# EAGLE schematic motion_detect (EAGLE 7.7.0)
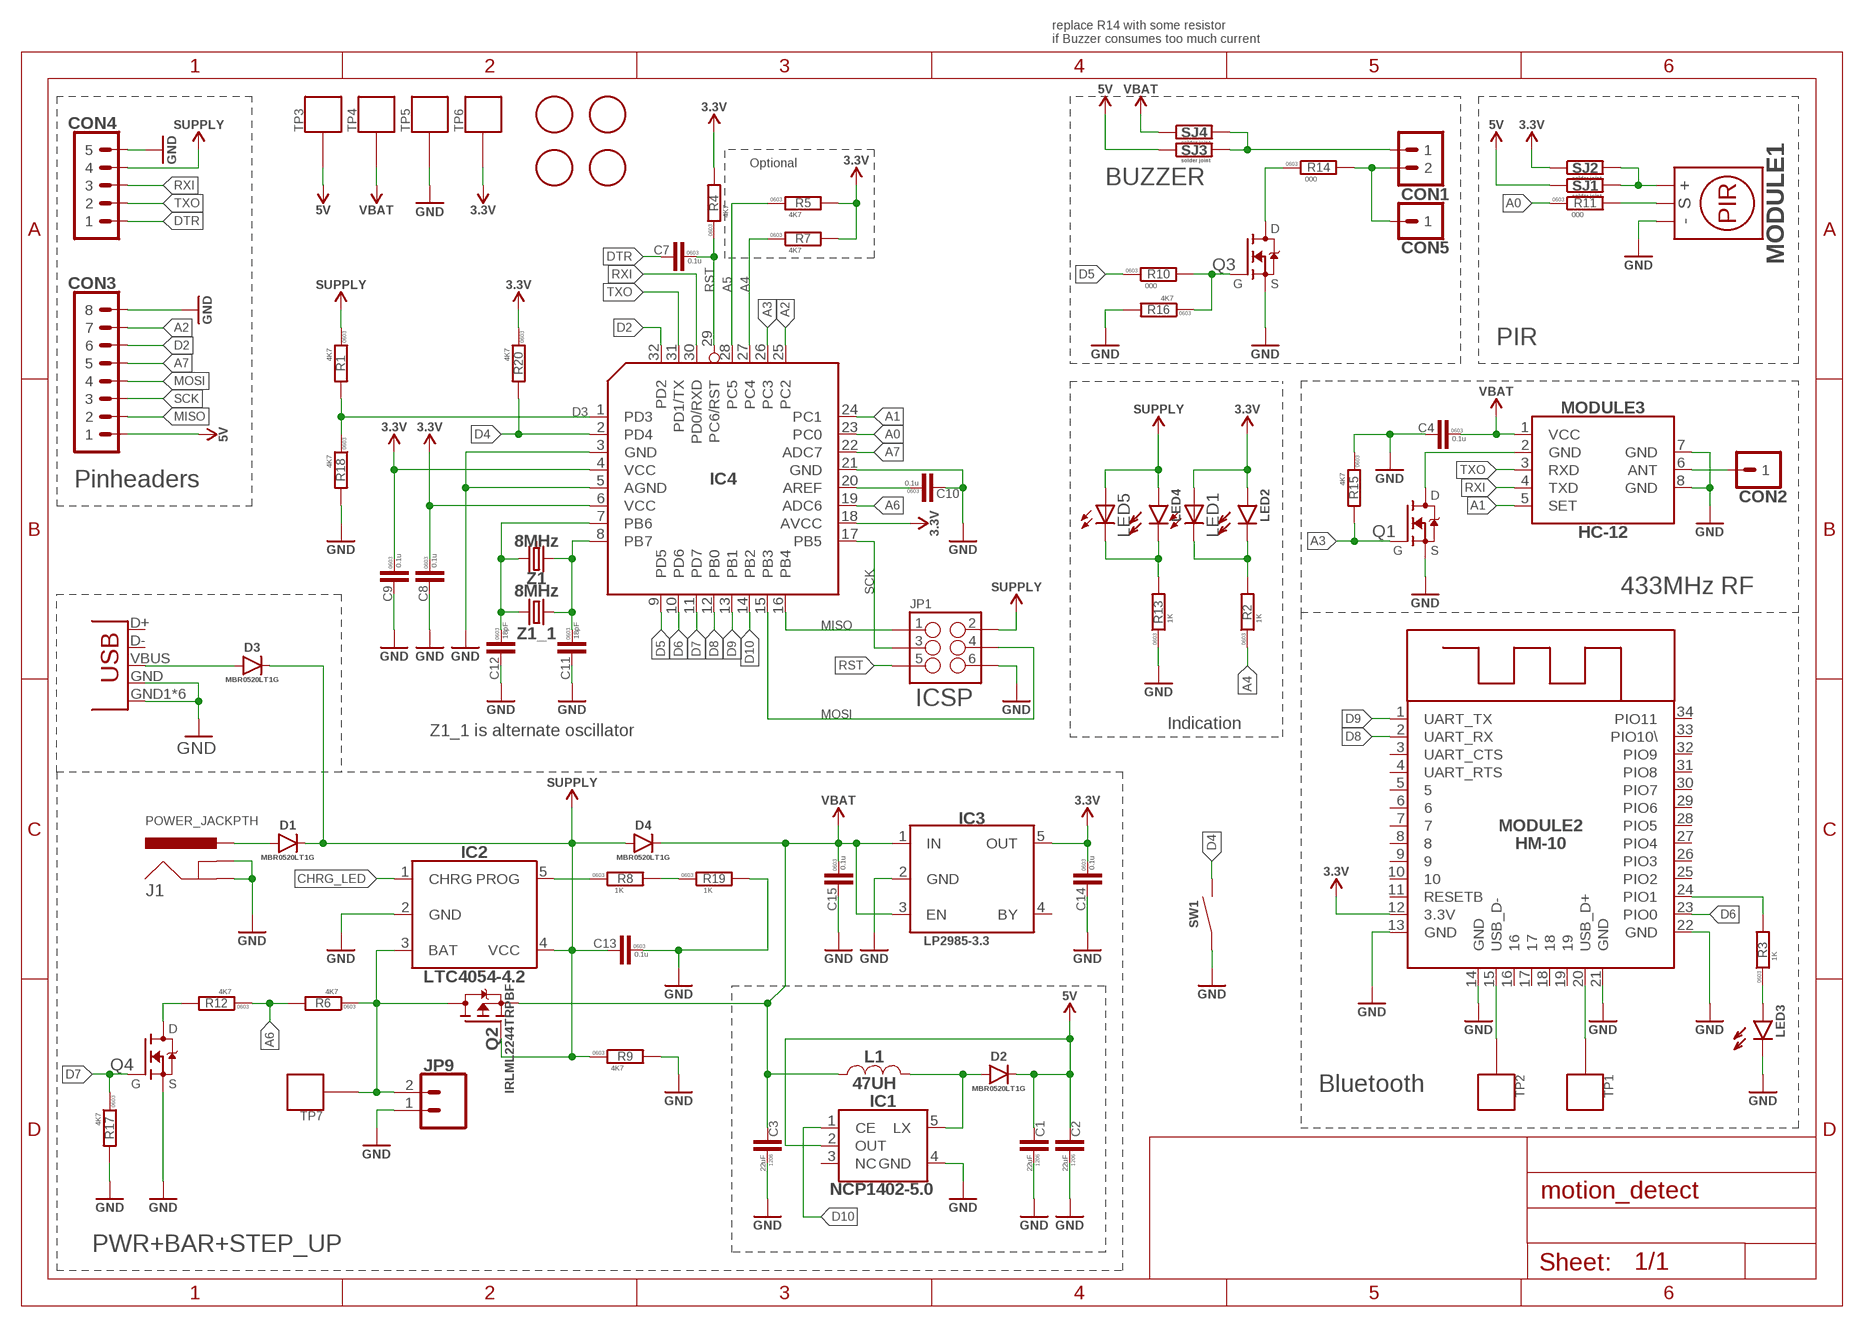
[diagram p0: schematic, sheet 1]

## Parts
C1  22uF  C-1206  [C1206]
C2  22uF  C-1206  [C1206]
C3  22uF  C-1206  [C1206]
C4  0.1u  C-0603  [C0603]
C7  0.1u  C-0603  [C0603]
C8  0.1u  C-0603  [C0603]
C9  0.1u  C-0603  [C0603]
C10  0.1u  C-0603  [C0603]
C11  18pF  C-0603  [C0603]
C12  18pF  C-0603  [C0603]
C13  0.1u  C-0603  [C0603]
C14  0.1u  C-0603  [C0603]
C15  0.1u  C-0603  [C0603]
CON1  PINHEAD_1X02-2.54  [1X02-PTH-2.54]
CON2  PINHEAD_1X01-2.54  [1X01-PTH-2.54]
CON3  PINHEAD_1X08-2.54  [1X08-PTH-2.54]
CON4  PINHEAD_1X05-2.54  [1X05-PTH-2.54]
CON5  PINHEAD_1X01-2.54  [1X01-PTH-2.54]
CON6  USB-2  [MICRO_USB_WITHOUT_PEGS]
D1  MBR0520L-SOD123  [SOD123]
D2  MBR0520L-SOD123  [SOD123]
D3  MBR0520L-SOD123  [SOD123]
D4  MBR0520L-SOD123  [SOD123]
IC1  5.0  NCP1402-5V  [SOT23-5]
IC2  LTC4054  [SOT23-5L]
IC3  3.3  LP2985-3.3V  [SOT23-5L]
IC4  ATMEGA168-TQFP32  [TQFP32-08]
J1  POWER_JACKPTH  [POWER_JACK_PTH]
JP1  M03X2POGO_PINS  [2X3_POGO]
JP9  M02-B2B-PH-K-S  [JST-2-PTH]
L1  47UH  INDUCTOR-SDR0403  [SDR0403]
LED1  LED-3MM  [LED-3MM]
LED2  LED-0603  [LED0603]
LED3  LED-0603  [LED0603]
LED4  LED-0603  [LED0603]
LED5  LED-3MM  [LED-3MM]
MODULE1  MOTION-PIR-DYP-ME003  [MOTION-PIR-DYP-ME003]
MODULE2  HM-10  [HM-10]
MODULE3  HC12  [HC-12]
Q1  IRLML2502-SOT23  [SOT23B-3]
Q2  IRLML2244TRPBF  [SOT23B-3]
Q3  IRLML2502-SOT23  [SOT23B-3]
Q4  IRLML2502-SOT23  [SOT23B-3]
R1  4K7  R-0603  [R0603]
R2  1K  R-0603  [R0603]
R3  1K  R-0603  [R0603]
R4  4K7  R-0603  [R0603]
R5  4K7  R-0603  [R0603]
R6  4K7  R-0603  [R0603]
R7  4K7  R-0603  [R0603]
R8  1K  R-0603  [R0603]
R9  4K7  R-0603  [R0603]
R10  000  R-0603  [R0603]
R11  000  R-0603  [R0603]
R12  4K7  R-0603  [R0603]
R13  1K  R-0603  [R0603]
R14  000  R-0603  [R0603]
R15  4K7  R-0603  [R0603]
R16  4K7  R-0603  [R0603]
R17  4K7  R-0603  [R0603]
R18  4K7  R-0603  [R0603]
R19  1K  R-0603  [R0603]
R20  4K7  R-0603  [R0603]
SJ1  SOLDER_JOINT  [RES_0]
SJ2  SOLDER_JOINT  [RES_0]
SJ3  SOLDER_JOINT  [RES_0]
SJ4  SOLDER_JOINT  [RES_0]
SW1  TACT_SWITCH  [IT-1102V]
TP1  PAD.05  [PAD.05X.05]
TP2  PAD.05  [PAD.05X.05]
TP3  PAD.05  [PAD.05X.05]
TP4  PAD.05  [PAD.05X.05]
TP5  PAD.05  [PAD.05X.05]
TP6  PAD.05  [PAD.05X.05]
TP7  PAD.05  [PAD.05X.05]
U$3  FIDUCIALMOUNT  [FIDUCIA-MOUNT]
U$4  FIDUCIALMOUNT  [FIDUCIA-MOUNT]
U$5  FIDUCIALMOUNT  [FIDUCIA-MOUNT]
U$6  FIDUCIALMOUNT  [FIDUCIA-MOUNT]
Z1  8MHz  CRYSTAL-3.2X2.5-4P  [OSCILLATOR-3.2X2.5]
Z1_1  8MHz  CRYSTAL-8MHZHC49UP  [HC49UP]

## Nets
A0: IC4.23(PC0) R11.1
A1: IC4.24(PC1) MODULE3.5(SET)
A2: CON3.7 IC4.25(PC2)
A3: IC4.26(PC3) Q1.1(G) R15.2
A4: IC4.27(PC4) R2.1 R7.1
A5: IC4.28(PC5) R5.1
A6: IC4.19(ADC6) R6.2 R12.1
A7: CON3.5 IC4.22(ADC7)
ANT: CON2.1 MODULE3.6(ANT)
BAT+: IC2.3(BAT) JP9.2 Q2.3(D) R6.1 TP7.P$1
CHRG_LED: IC2.1(CHRG)
D2: CON3.6 IC4.32(PD2)
D3: IC4.1(PD3) R1.2 R18.1
D4: IC4.2(PD4) R20.2 SW1.P$2
D5: IC4.9(PD5) R10.1
D6: IC4.10(PD6) MODULE2.23(PIO0)
D7: IC4.11(PD7) Q4.1(G) R17.1
D8: IC4.12(PB0) MODULE2.2(UART_RX)
D9: IC4.13(PB1) MODULE2.1(UART_TX)
D10: IC1.1(CE) IC4.14(PB2)
DTR: C7.2 CON4.1
GND: C1.P$1 C2.P$1 C3.P$1 C4.2 C8.2 C9.2 C10.2 C11.2 C12.2 C13.1 C14.2 C15.2 CON3.8 CON4.5 CON6.GND CON6.GND1(SHIELD) CON6.GND2(SHIELD) CON6.GND3(SHIELD) CON6.GND4(SHIELD) CON6.GND5(SHIELD) CON6.GND6(SHIELD) IC1.4(GND) IC2.2(GND) IC3.2(GND) IC4.3(GND) IC4.5(AGND) IC4.21(GND) J1.GND J1.GNDBREAK JP1.P$6 JP9.1 LED3.C MODULE1.1(GND) MODULE2.13(GND) MODULE2.14(GND) MODULE2.21(GND) MODULE2.22(GND) MODULE3.7(GND) MODULE3.8(GND) Q1.2(S) Q3.2(S) Q4.2(S) R9.2 R13.1 R15.1 R16.2 R17.2 R18.2 R19.2 SW1.P$1 TP5.P$1
MISO: CON3.2 IC4.16(PB4) JP1.P$1
MOSI: CON3.4 IC4.15(PB3) JP1.P$4
N$1: MODULE3.2(GND) Q1.3(D)
N$2: LED1.K(C) LED2.C R2.2
N$3: LED3.A R3.1
N$4: C10.1 IC4.20(AREF)
N$5: D2.A IC1.5(LX) L1.P$2
N$6: C12.1 IC4.7(PB6) Z1.3 Z1_1.2
N$7: R8.2 R19.1
N$8: C11.1 IC4.8(PB7) Z1.1 Z1_1.1
N$9: IC2.5(PROG) R8.1
N$10: CON6.VBUS D3.A
N$11: MODULE1.2(OUT) R11.2
N$12: LED4.C LED5.K(C) R13.2
N$13: D1.A J1.PWR
N$15: Q3.1(G) R10.2 R16.1
N$16: MODULE2.15(USB_D-) TP2.P$1
N$17: MODULE1.3(VCC) SJ1.2 SJ2.2
N$18: MODULE2.20(USB_D+) TP1.P$1
N$19: MODULE2.24(PIO1) R3.2
N$20: Q3.3(D) R14.1
N$21: Q4.3(D) R12.2
N$22: CON1.1 SJ3.2 SJ4.2
N$23: CON1.2 CON5.1 R14.2
RST: C7.1 IC4.29(PC6/RST) JP1.P$5 R4.1
RXI: CON4.3 IC4.30(PD0/RXD) MODULE3.4(TXD)
SCK: CON3.3 IC4.17(PB5) JP1.P$3
SUP: C13.2 CON4.4 D1.C D3.C D4.A IC2.4(VCC) JP1.P$2 LED4.A LED5.A Q2.1(G) R1.1 R9.1 ; supply symbol labelled SUPPLY
TXO: CON4.2 IC4.31(PD1/TX) MODULE3.3(RXD)
VBAT: C3.P$2 C4.1 C15.1 D4.C IC3.1(IN) IC3.3(EN) L1.P$1 MODULE3.1(VCC) Q2.2(S) SJ4.1 TP4.P$1
VDD_3V3: C8.1 C9.1 C14.1 IC3.5(OUT) IC4.4(VCC) IC4.6(VCC) IC4.18(AVCC) LED1.A LED2.A MODULE2.12(3.3V) R4.2 R5.2 R7.2 R20.1 SJ2.1 TP6.P$1 ; supply symbol labelled 3.3V
VDD_5V: C1.P$2 C2.P$2 CON3.1 D2.C IC1.2(OUT) SJ1.1 SJ3.1 TP3.P$1 ; supply symbol labelled 5V
Unconnected: CON6.D+ CON6.D- IC1.3(NC) IC3.4(BY) MODULE2.3(UART_CTS) MODULE2.4(UART_RTS) MODULE2.5 MODULE2.6 MODULE2.7 MODULE2.8 MODULE2.9 MODULE2.10 MODULE2.11(RESETB) MODULE2.16 MODULE2.17 MODULE2.18 MODULE2.19 MODULE2.25(PIO2) MODULE2.26(PIO3) MODULE2.27(PIO4) MODULE2.28(PIO5) MODULE2.29(PIO6) MODULE2.30(PIO7) MODULE2.31(PIO8) MODULE2.32(PIO9) MODULE2.33(PIO10\) MODULE2.34(PIO11) Z1.2(GND) Z1.4(GND)

## Notes on the sheet
- replace R14 with some resistor 
  if Buzzer consumes too much current
- Optional
- BUZZER
- PIR
- Pinheaders
- 433MHz RF
- ICSP
- Indication
- Z1_1 is alternate oscillator
- Bluetooth
- PWR+BAR+STEP_UP

## Library data of the parts
C1-C3 = rc:C; PACKAGE: 1206
C4 C7-C15 = rc:C; PACKAGE: 0603
CON1 = pinhead:PINHEAD_1X02: pinheader 2P
CON2 CON5 = pinhead:PINHEAD_1X01: pinheader 1P; BOM: EXCLUDE
CON3 = pinhead:PINHEAD_1X08: pinheader 8P
CON4 = pinhead:PINHEAD_1X05: pinheader 5P
CON6 = led_matrix_master_lib:USB: Connector Receptacle USB - micro B 2.0 5 Position; DIGIKEY#: 609-4613-1-ND; LINK: http://www.chipdip.ru/product/molex-47346-0001/; MANF: FCI; MANF#: 10118192-0001LF
D1-D4 = motion_detect_masterlib:MBR0520L: DIODE SCHOTTKY 20V 500MA SOD123; DIGIKEY#: MBR0520LT1GOSTR-ND; MANF: ON Semiconductor; MANF#: MBR0520LT1G
IC1 = motion_detect_masterlib:NCP1402: IC REG BOOST 5V 0.13A 5TSOP; DIGIKEY#: NCP1402SN50T1GOSCT-ND; LINK: https://www.chipdip.ru/product/ncp1402sn50t1g; MANF: ON Semiconductor; MANF#: NCP1402SN50T1G
IC2 = gradus_mater_lib:LTC4054: IC CHARG BATTERY L-ION TSOT23-5; DIGIKEY#: LTC4054LES5-4.2#TRPBFCT-ND; MANF: Linear Technology; MANF#: LTC4054LES5-4.2#TRPBF
IC3 = motion_detect_masterlib:LP2985-3.3V: IC REG LDO 3.3V 0.15A SOT23-5; DIGIKEY#: 296-18476-1-ND; MANF: Texas Instruments; MANF#: LP2985-33DBVR
IC4 = motion_detect_masterlib:ATMEGA168; MANF#: ATMEGA168
J1 = SparkFun-Connectors:POWER_JACK: Power Jack This is the standard 5.5mm barrel jack for power. The PTH is the most common, proven, reliable, footprint. The Slot footprint only works if the mill layer is transmitted to the PCB fab house so be warned. Spark Fun Electronics SKU : PRT-00119 SMT: CONN-08106 Mating wall wart : TOL-00298 (and others)
JP1 = SparkFun-Connectors:M03X2: 2x3 .1" header. Shrouded, with keying- CONN-10681 SMT- CONN-11415 Pogo pins- HW-11044; PROD_ID: HW-11044
JP9 = ExitControl_v2_master_library:M02: Header 2 Standard 2-pin 0.1" header. Use with straight break away headers (SKU : PRT-00116), right angle break away headers (PRT-00553), swiss pins (PRT-00743), machine pins (PRT-00117), and female headers (PRT-00115). Molex polarized connector foot print use with SKU : PRT-08233 with associated crimp pins and housings.; COMPEL: http://www.compel.ru/infosheet/JST/B2B-PH-K-S%5BLF%5D%5BSN%5D/; DIGIKEY#: 455-1704-ND; MANF: B2B-PH-K-S(LF)(SN); MANF#: JST Sales America Inc
L1 = motion_detect_masterlib:INDUCTOR: Unshielded Wirewound Inductor; LINK: https://www.chipdip.ru/product/sdr0403-470k
LED1 LED5 = dp_devices:LED: Light Emitting Diode; ASSEMBLY: SPECIAL; BOM: OPTIONAL; COLOR: RED; LINK: http://www.zip-2002.ru/osveshchenie_i_indikatsiya/svetodiody/86349/1x3x4_red_50_mcd_2,1v/
LED2 = rc:LED: SMD LED; COLOR: GREEN
LED3 = rc:LED: SMD LED; ASSY: DNM; COLOR: blue
LED4 = rc:LED: SMD LED; COLOR: RED
MODULE1 = diy-modules:MOTION-PIR-DYP-ME003: PIR Motion Sensor Module DYP-ME003 based on BISS0001 pyroelectic detector Click here to find device on ebay.com <http://www.ebay.com/sch/dyp+me003>
MODULE2 = motion_detect_masterlib:HM-10
MODULE3 = motion_detect_masterlib:HC12
Q1 Q3 Q4 = motion_detect_masterlib:IRLML2502: MOSFET N-CH 20V 4.2A SOT-23; DIGIKEY#: IRLML2502PBFTR-ND; MANF: Infineon Technologies; MANF#: IRLML2502TRPBF
Q2 = motion_detect_masterlib:IRLML2244TRPBF: MOSFET P-CH 20V 4.3A SOT23; DIGIKEY#: IRLML2244TRPBFCT-ND; LINK: https://www.chipdip.ru/product/irlml2244trpbf; MANF: Infineon Technologies; MANF#: IRLML2244TRPBF
R1 R2 R6 R8-R14 R16-R20 = rc:R; PACKAGE: 0603
R3-R5 R7 R15 = rc:R; ASSY: DNM; PACKAGE: 0603
SJ1-SJ4 = eth_conv_master_lib:SOLDER_JOINT; ASSY: DNM; BOM: EXCLUDE
SW1 = motion_detect_masterlib:TACT_SWITCH; LINK: https://www.chipdip.ru/product/it-1102v
TP1-TP7 = pixhawk2:PAD: Test pad This footprint includes three classes: The actual test pads, a pogo-pin footprint to mount the pogo-pin as through-hole part and a hole footprint which allows the head of the pogo-pin to pass through (do NOT use the hole to mount the pogo-pin). In a typical test setup, the stack would consist of three PCBs: The actual PCB under testing with a test pad on the bottom, then a second PCB with the hole for the pogo-pin head where the PCB under testing is pressed on and a third PCB at 30 mm / 1.2" distance with the pogo-pin footprints. The pogo-pins are soldered to the last PCB. To create the stack, copy the board under testing and exchange the footprints - this way the correct positioning is ensured.; BOM: EXCLUDE; PARTNO: *
U$3-U$6 = eth_conv_master_lib:FIDUCIALMOUNT; BOM: EXCLUDE
Z1 = led_matrix_master_lib:CRYSTAL: Smd Crystal; LINK: https://www.chipdip.ru/product/7b-8.000maaj-t; VALUE: 16MHz
Z1_1 = ExitControl_v2_master_library:CRYSTAL-8MHZ: Crystal 8.0000MHz 30ppm 18pF 40 Ohm -20°C - 70°C Surface Mount HC49/US; DIGIKEY#: 535-10212-1-ND; MANF: Abracon LLC; MANF#: ABLS-8.000MHZ-B4-T

## Net classes
1 vcc: width 0.254 mm